# Altium schematic sheet Connectors.SchDoc: C2S Connectors
size A4; SheetNumber: 5; SheetTotal: 5
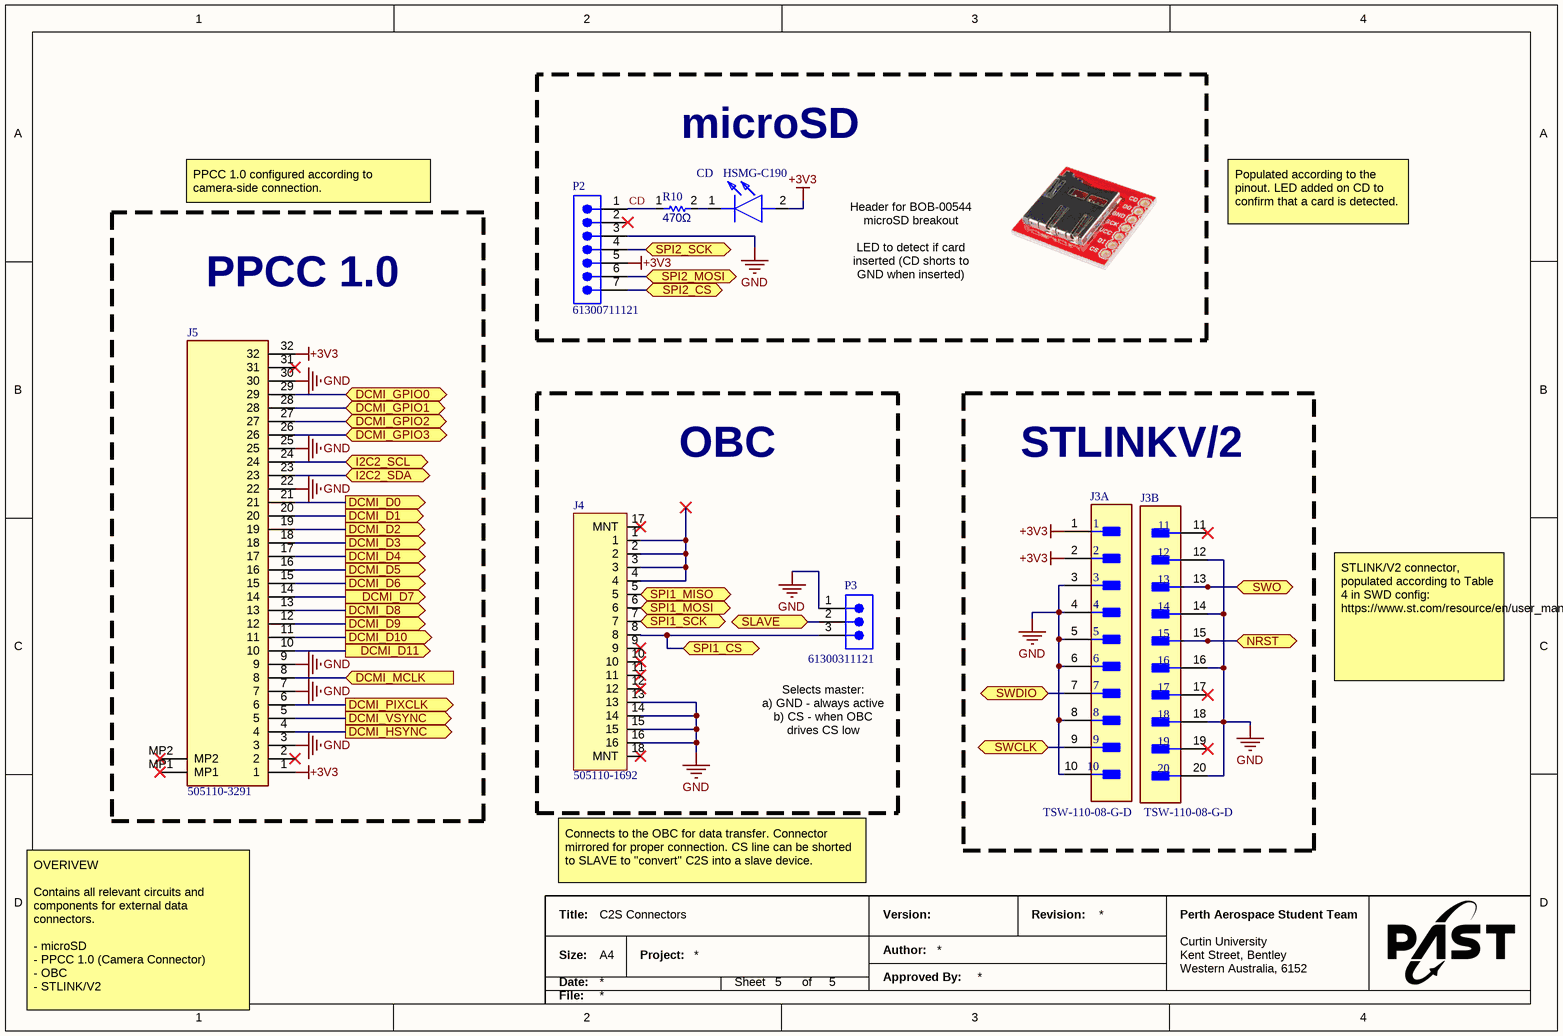
[diagram p0: Connectors.SchDoc]

## Parts
CD  HSMG-C190  [LEDC1608X90N]
J3  TSW-110-08-G-D  [FP-TSW-110-08-G-D-MFG]  (parts A,B of 2)
J4  505110-1692  [FP-505110-1692-MFG]
J5  505110-3291  [5051103291]
P2  61300711121  [61300711121]
P3  61300311121  [61300311121]
R10  value 470Ω  [FP-CRCW0603-e3-IPC_C]  (hidden comment: CRCW0603470RFKEC)

## Blocks framed on the sheet
microSD: CD P2 R10
PPCC 1.0: J5
OBC: J4 P3
STLINKV/2: J3

## Ports
DCMI_D0 (out), DCMI_D1 (out), DCMI_D2 (out), DCMI_D3 (out), DCMI_D4 (out), DCMI_D5 (out), DCMI_D6 (out), DCMI_D7 (out), DCMI_D8 (out), DCMI_D9 (out), DCMI_D10 (out), DCMI_D11 (out), DCMI_GPIO0 (bidir), DCMI_GPIO1 (bidir), DCMI_GPIO2 (bidir), DCMI_GPIO3 (bidir), DCMI_HSYNC (out), DCMI_MCLK (in), DCMI_PIXCLK (out), DCMI_VSYNC (out), I2C2_SCL (bidir), I2C2_SDA (bidir), NRST (bidir), SLAVE (bidir), SPI1_CS (bidir), SPI1_MISO (bidir), SPI1_MOSI (bidir), SPI1_SCK (bidir), SPI2_CS (bidir), SPI2_MOSI (bidir), SPI2_SCK (bidir), SWCLK (bidir), SWDIO (bidir), SWO (bidir)

## Nets
+3V3: CD.2(A) J3.1 J3.2 J5.1 J5.32 P2.5
GND: J3.3 J3.4 J3.5 J3.6 J3.8 J3.10 J3.12 J3.14 J3.16 J3.18 J3.20 J4.13 J4.14 J4.15 J4.16 J5.3 J5.7 J5.9 J5.22 J5.25 J5.30 P2.3 P3.1
CD: P2.1 R10.1
DCMI_D0: J5.21 ; port DCMI_D0
DCMI_D1: J5.20 ; port DCMI_D1
DCMI_D2: J5.19 ; port DCMI_D2
DCMI_D3: J5.18 ; port DCMI_D3
DCMI_D4: J5.17 ; port DCMI_D4
DCMI_D5: J5.16 ; port DCMI_D5
DCMI_D6: J5.15 ; port DCMI_D6
DCMI_D7: J5.14 ; port DCMI_D7
DCMI_D8: J5.13 ; port DCMI_D8
DCMI_D9: J5.12 ; port DCMI_D9
DCMI_D10: J5.11 ; port DCMI_D10
DCMI_D11: J5.10 ; port DCMI_D11
DCMI_GPIO0: J5.29 ; port DCMI_GPIO0
DCMI_GPIO1: J5.28 ; port DCMI_GPIO1
DCMI_GPIO2: J5.27 ; port DCMI_GPIO2
DCMI_GPIO3: J5.26 ; port DCMI_GPIO3
DCMI_HSYNC: J5.4 ; port DCMI_HSYNC
DCMI_MCLK: J5.8 ; port DCMI_MCLK
DCMI_PIXCLK: J5.6 ; port DCMI_PIXCLK
DCMI_VSYNC: J5.5 ; port DCMI_VSYNC
I2C2_SCL: J5.24 ; port I2C2_SCL
I2C2_SDA: J5.23 ; port I2C2_SDA
NRST: J3.15 ; port NRST
SLAVE: P3.2 ; port SLAVE
SPI1_CS: J4.8 P3.3 ; port SPI1_CS
SPI1_MISO: J4.5 ; port SPI1_MISO
SPI1_MOSI: J4.6 ; port SPI1_MOSI
SPI1_SCK: J4.7 ; port SPI1_SCK
SPI2_CS: P2.7 ; port SPI2_CS
SPI2_MOSI: P2.6 ; port SPI2_MOSI
SPI2_SCK: P2.4 ; port SPI2_SCK
SWCLK: J3.9 ; port SWCLK
SWDIO: J3.7 ; port SWDIO
SWO: J3.13 ; port SWO
NetCD_1: CD.1(K) R10.2
NetJ4_1: J4.1 J4.2 J4.3 J4.4

Not connected (* = marked no-connect by the designer): J3 11* 17* 19*; J4 9* 10* 11* 12* 17(MNT)* 18(MNT)*; J5 2* 31* MP1* MP2*; P2 2*

## Notes on the sheet
- PPCC 1.0 configured according to camera-side connection.
- Populated according to the pinout. LED added on CD to confirm that a card is detected.
- Header for BOB-00544 microSD breakout
  LED to detect if card inserted (CD shorts to GND when inserted)
- STLINK/V2 connector, populated according to Table 4 in SWD config: https://www.st.com/resource/en/user_manual/um1075-stlinkv2-incircuit-debuggerprogrammer-for-stm8-and-stm32-stmicroelectronics.pdf
- (near P3) Selects master:
  a) GND - always active
  b) CS - when OBC drives CS low
- Connects to the OBC for data transfer. Connector mirrored for proper connection. CS line can be shorted to SLAVE to "convert" C2S into a slave device.
- OVERIVEW
  Contains all relevant circuits and components for external data connectors.
  - microSD
  - PPCC 1.0 (Camera Connector)
  - OBC
  - STLINK/V2
- Title:
- Version:
- Revision:
- Perth Aerospace Student Team
- Size:
- Date:
- A4
- Project:
- Sheet
- of
- Author:
- Approved By:
- Curtin University
- Kent Street, Bentley
- Western Australia, 6152
- File:

## Library data of the parts
CD = CMP-062-000014-1: LED; Manufacturer_Name: Avago Technologies; Mouser Part Number: 630-HSMG-C190; Manufacturer_Part_Number: HSMG-C190; Mouser Price/Stock: https://www.mouser.co.uk/ProductDetail/Broadcom-Avago/HSMG-C190?qs=YDL0qNrpDT605sxOaps8VQ%3D%3D; Datasheet Link: https://docs.broadcom.com/docs/AV02-0551EN; Source: SamacSys.SchLib; Design Item ID: HSMG-C190; Height: 0.9mm
J3 = CMP-02766-000083-1: CONN HEADER VERT 20POS 2.54MM; Manufacturer: Samtec; Conn Gender: Male; Number Of Contacts: 20; Conn Orientation: Straight; Lead Free: Yes; Category: Conn; Manufacturer Part Number: TSW-110-08-G-D; Temperature Range High: +125°C; Pitch: 2.54mm; Temperature: -55°C to +125°C; Automotive: No; Device Class L1: Connectors; ComponentLink2URL: http://suddendocs.samtec.com/prints/tsw-xxx-xx-xxx-x-xx-xxx-mkt.pdf; Temperature Range Low: -55°C; ComponentLink2Description: Datasheet; Height: 8.71mm; Number Of Rows: 2; Digikey Description: CONN HEADER VERT 20POS 2.54MM; Package: TSW-110-08-G-D; Device Class L3: unset; Contact Material: Gold,Nickel; Octopart: https://octopart.com/tsw-110-08-g-d-samtec-272555; Footprint Url: http://suddendocs.samtec.com/prints/tsw-xxx-xx-x-x-xx-xxx-footprint.pdf; RoHS: TRUE; Ipc Land Pattern Name: CAPAD1016W80L630D240; Device Class L2: Headers and Wire Housings
J4 = CMP-002-00119-1: Conn FFC/FPC Connector SKT 16 POS 0.5mm Solder RA SMD Easy-On™ T/R
J5 = CMP-220-000001-1: Easy-On FFC/FPC Connector; Manufacturer_Name: Molex; Added By: Felix Abbott; Mouser Part Number: 538-505110-3291; Height: 4.06mm; Source: Schlib1.SchLib; Manufacturer_Part_Number: 505110-3291; Mouser Price/Stock: https://www.mouser.co.uk/ProductDetail/Molex/505110-3291?qs=0lSvoLzn4L9xGyl4KYdheA%3D%3D; Design Item ID: 505110-3291; Datasheet Link: https://www.molex.com/pdm_docs/sd/5051103291_sd.pdf
P2 = CMP-096-000168-1: WR-PHD Pin Header, THT, Vertical, pitch 2.54mm, 1 Row, 7P; Manufacturer: Wurth Elektronik; Rated Current: 3A; Withstanding Voltage: 500V; Working Voltage: 250V; Contact Resistance: 20mOhm; Match Code: WR-PHD; Orientation: Vertical; Component Type: Standard; Source: WR-PHD.SchLib; ComponentLink1URL: https://www.we-online.com/redexpert/article/61300711121?ad; Mount: Through Hole; Category: Board-to-Board Connectors; Packaging: Bag; Operating Temperature Max: 105°C; Number of Pins: 7; Design Item ID: 61300711121; Operating Temperature Min: -40°C; Pin Count: 7; Pitch: 2.54mm; Number of Rows: 1; Gender: Pin Header; Manufacturer Part Number: 61300711121; ComponentLink1Description: Website Link; ComponentLink2URL: https://www.we-online.com/redexpert/spec/61300711121?ad; ComponentLink2Description: Datasheet Link
P3 = CMP-096-000137-1: WR-PHD Pin Header, THT, Vertical, pitch 2.54mm, 1 Row, 3P; Manufacturer: Wurth Elektronik; Contact Resistance: 20mOhm; Rated Current: 3A; Withstanding Voltage: 500V; Working Voltage: 250V; Operating Temperature Max: 105°C; Manufacturer Part Number: 61300311121; Match Code: WR-PHD; ComponentLink2Description: Datasheet Link; ComponentLink1Description: Website Link; Number of Pins: 3; Orientation: Vertical; Mount: Through Hole; Gender: Pin Header; Pin Count: 3; ComponentLink2URL: https://www.we-online.com/redexpert/spec/61300311121?ad; Pitch: 2.54mm; Packaging: Bag; Operating Temperature Min: -40°C; ComponentLink1URL: https://www.we-online.com/redexpert/article/61300311121?ad; Component Type: Standard; Design Item ID: 61300311121; Source: WR-PHD.SchLib; Category: Board-to-Board Connectors; Number of Rows: 1
R10 = CMP-009-00206-1: Resistor; Power Dissipation: 100mW; Voltage Rating: 75V; Tolerance: 1%; Added By: Felix; Temperature Coefficient: 100ppm/°C; China RoHS: Non-Compliant; Mounting Technology: Surface Mount; Export Control Classification Number (ECCN) Code: EAR99; Depth: 850µm; Number of Terminals: 2; REACH SVHC: Yes; Case/Package: 0603; Harmonized Tariff Schedule (HTS) Code: 8533.21.00.30; Lifecycle Status: Production; Max Operating Temperature: 155°C; Length: 1.55mm; Lead Free: Lead Free; Max Power Dissipation: 100mW; RoHS: Compliant; Height: 450µm; Min Operating Temperature: -55°C; Width: 850µm; Country of Origin: Israel, Taiwan; Composition: Thick Film; Military Standard: Not; Number of Terminations: 2; Features: Automotive AEC-Q200; Packaging: Tape & Reel (TR); Power Rating: 100mW; Introduction Date: 2005-02-16; Working Voltage: 75V